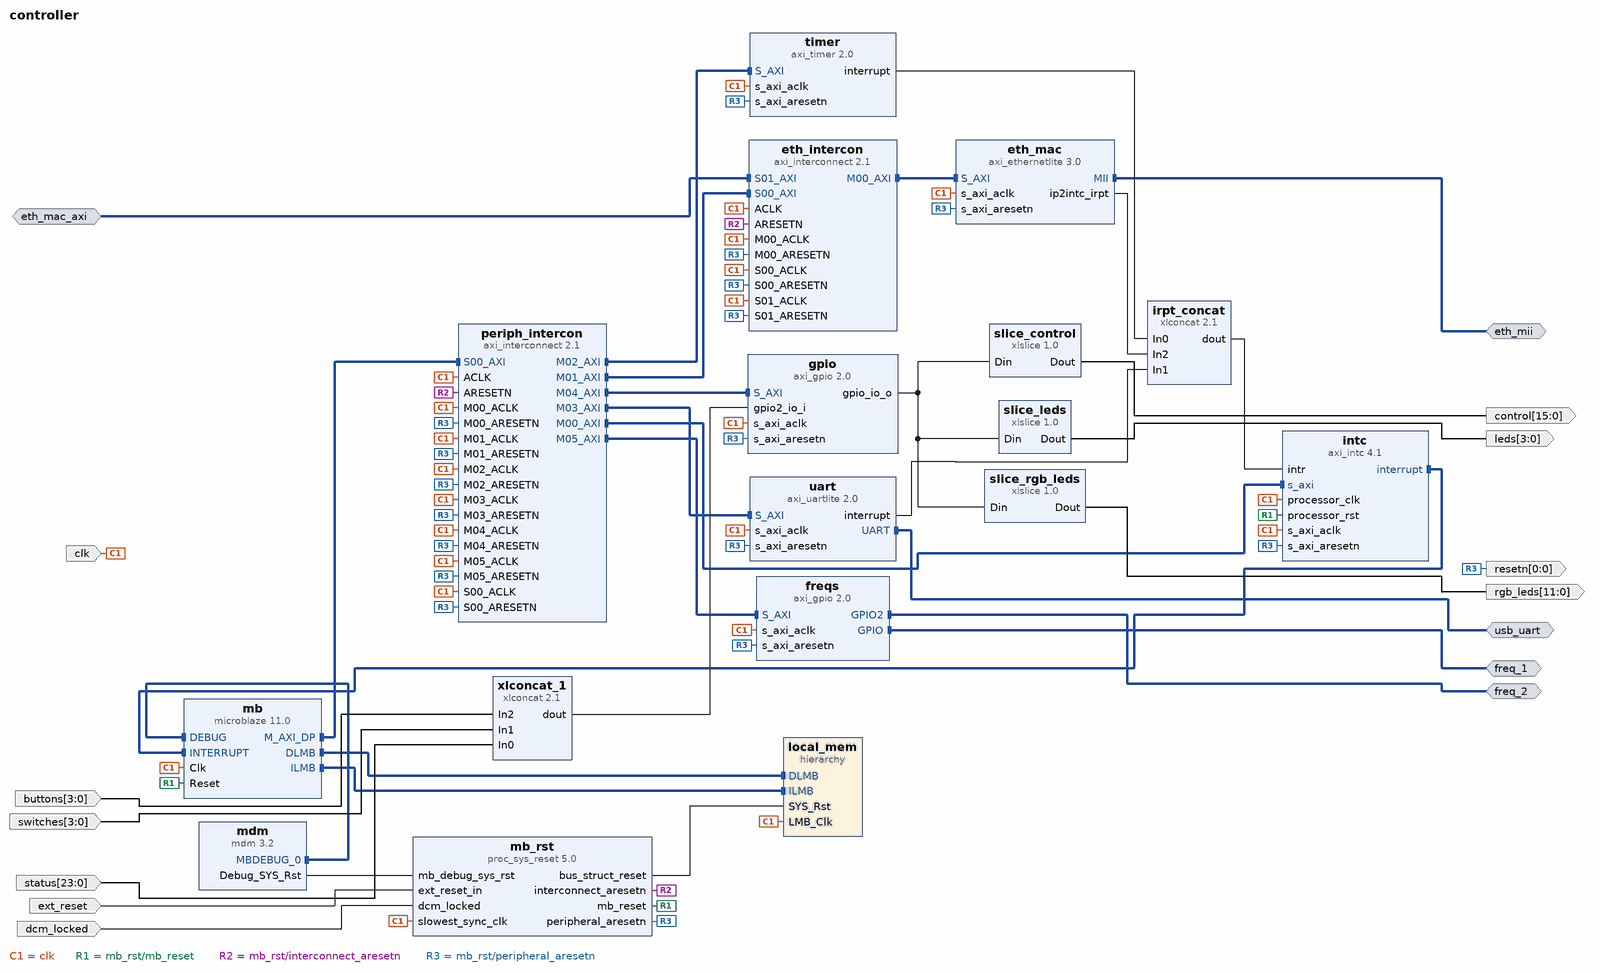
[diagram p0: block diagram of the top level]
# Vivado block design controller, xc7a35ticsg324-1L, Vivado 2019.1
create_bd_design controller

create_bd_intf_port -mode Master -vlnv xilinx.com:interface:mii_rtl:1.0 eth_mii
create_bd_intf_port -mode Slave -vlnv xilinx.com:interface:aximm_rtl:1.0 eth_mac_axi
set_property -dict [list \
  CONFIG.ADDR_WIDTH 32 \
  CONFIG.ARUSER_WIDTH 0 \
  CONFIG.AWUSER_WIDTH 0 \
  CONFIG.BUSER_WIDTH 0 \
  CONFIG.DATA_WIDTH 32 \
  CONFIG.HAS_BRESP 1 \
  CONFIG.HAS_BURST 1 \
  CONFIG.HAS_CACHE 1 \
  CONFIG.HAS_LOCK 1 \
  CONFIG.HAS_PROT 1 \
  CONFIG.HAS_QOS 1 \
  CONFIG.HAS_REGION 0 \
  CONFIG.HAS_RRESP 1 \
  CONFIG.HAS_WSTRB 1 \
  CONFIG.ID_WIDTH 0 \
  CONFIG.MAX_BURST_LENGTH 1 \
  CONFIG.NUM_READ_OUTSTANDING 2 \
  CONFIG.NUM_READ_THREADS 1 \
  CONFIG.NUM_WRITE_OUTSTANDING 2 \
  CONFIG.NUM_WRITE_THREADS 1 \
  CONFIG.PROTOCOL AXI4LITE \
  CONFIG.READ_WRITE_MODE READ_WRITE \
  CONFIG.RUSER_BITS_PER_BYTE 0 \
  CONFIG.RUSER_WIDTH 0 \
  CONFIG.SUPPORTS_NARROW_BURST 0 \
  CONFIG.WUSER_BITS_PER_BYTE 0 \
  CONFIG.WUSER_WIDTH 0 \
] [get_bd_intf_ports eth_mac_axi]
create_bd_intf_port -mode Master -vlnv xilinx.com:interface:uart_rtl:1.0 usb_uart
create_bd_intf_port -mode Master -vlnv xilinx.com:interface:gpio_rtl:1.0 freq_1
create_bd_intf_port -mode Master -vlnv xilinx.com:interface:gpio_rtl:1.0 freq_2
create_bd_port -dir I -type clk clk
set_property -dict {CONFIG.ASSOCIATED_RESET resetn CONFIG.FREQ_HZ 100000000} [get_bd_ports clk]
create_bd_port -dir O -from 0 -to 0 -type rst resetn
create_bd_port -dir I -type rst ext_reset
set_property -dict {CONFIG.POLARITY ACTIVE_LOW} [get_bd_ports ext_reset]
create_bd_port -dir I dcm_locked
create_bd_port -dir O -from 11 -to 0 rgb_leds
create_bd_port -dir O -from 15 -to 0 control
create_bd_port -dir O -from 3 -to 0 leds
create_bd_port -dir I -from 3 -to 0 buttons
create_bd_port -dir I -from 3 -to 0 switches
create_bd_port -dir I -from 23 -to 0 status

create_bd_cell -type hier local_mem
create_bd_cell -type ip -vlnv xilinx.com:ip:axi_intc:4.1 intc
set_property -dict {CONFIG.C_HAS_FAST 1} [get_bd_cells intc]
create_bd_cell -type ip -vlnv xilinx.com:ip:xlconcat:2.1 irpt_concat
set_property -dict {CONFIG.NUM_PORTS 3 CONFIG.dout_width 3} [get_bd_cells irpt_concat]
create_bd_cell -type ip -vlnv xilinx.com:ip:xlslice:1.0 slice_control
set_property -dict {CONFIG.DIN_FROM 15 CONFIG.DOUT_WIDTH 16} [get_bd_cells slice_control]
create_bd_cell -type ip -vlnv xilinx.com:ip:xlslice:1.0 slice_leds
set_property -dict {CONFIG.DIN_FROM 19 CONFIG.DIN_TO 16 CONFIG.DOUT_WIDTH 4} [get_bd_cells slice_leds]
create_bd_cell -type ip -vlnv xilinx.com:ip:xlslice:1.0 slice_rgb_leds
set_property -dict {CONFIG.DIN_FROM 31 CONFIG.DIN_TO 20 CONFIG.DIN_WIDTH 32 CONFIG.DOUT_WIDTH 12} [get_bd_cells slice_rgb_leds]
create_bd_cell -type ip -vlnv xilinx.com:ip:xlconcat:2.1 xlconcat_1
set_property -dict [list \
  CONFIG.IN0_WIDTH 24 \
  CONFIG.IN1_WIDTH 4 \
  CONFIG.IN2_WIDTH 4 \
  CONFIG.NUM_PORTS 3 \
  CONFIG.dout_width 32 \
] [get_bd_cells xlconcat_1]
create_bd_cell -type ip -vlnv xilinx.com:ip:axi_interconnect:2.1 eth_intercon
set_property -dict [list \
  CONFIG.ENABLE_ADVANCED_OPTIONS 1 \
  CONFIG.NUM_MI 1 \
  CONFIG.NUM_SI 2 \
  CONFIG.SYNCHRONIZATION_STAGES 2 \
] [get_bd_cells eth_intercon]
create_bd_cell -type ip -vlnv xilinx.com:ip:microblaze:11.0 mb
set_property -dict {CONFIG.C_DEBUG_ENABLED 1 CONFIG.C_D_AXI 1 CONFIG.C_D_LMB 1 CONFIG.C_I_LMB 1} [get_bd_cells mb]
create_bd_cell -type ip -vlnv xilinx.com:ip:mdm:3.2 mdm
create_bd_cell -type ip -vlnv xilinx.com:ip:axi_interconnect:2.1 periph_intercon
set_property -dict {CONFIG.NUM_MI 6 CONFIG.SYNCHRONIZATION_STAGES 2} [get_bd_cells periph_intercon]
create_bd_cell -type ip -vlnv xilinx.com:ip:axi_timer:2.0 timer
create_bd_cell -type ip -vlnv xilinx.com:ip:axi_ethernetlite:3.0 eth_mac
set_property -dict [list \
  CONFIG.C_INCLUDE_MDIO 0 \
  CONFIG.MDIO_BOARD_INTERFACE Custom \
  CONFIG.MII_BOARD_INTERFACE Custom \
  CONFIG.USE_BOARD_FLOW true \
] [get_bd_cells eth_mac]
create_bd_cell -type ip -vlnv xilinx.com:ip:axi_gpio:2.0 freqs
set_property -dict [list \
  CONFIG.C_ALL_OUTPUTS 1 \
  CONFIG.C_ALL_OUTPUTS_2 1 \
  CONFIG.C_DOUT_DEFAULT 0x00000EB8 \
  CONFIG.C_DOUT_DEFAULT_2 0x00001008 \
  CONFIG.C_IS_DUAL 1 \
] [get_bd_cells freqs]
create_bd_cell -type ip -vlnv xilinx.com:ip:axi_gpio:2.0 gpio
set_property -dict {CONFIG.C_ALL_INPUTS 0 CONFIG.C_ALL_INPUTS_2 1 CONFIG.C_ALL_OUTPUTS 1 CONFIG.C_IS_DUAL 1} [get_bd_cells gpio]
create_bd_cell -type ip -vlnv xilinx.com:ip:proc_sys_reset:5.0 mb_rst
set_property -dict {CONFIG.RESET_BOARD_INTERFACE Custom CONFIG.USE_BOARD_FLOW false} [get_bd_cells mb_rst]
create_bd_cell -type ip -vlnv xilinx.com:ip:axi_uartlite:2.0 uart
set_property -dict {CONFIG.UARTLITE_BOARD_INTERFACE Custom CONFIG.USE_BOARD_FLOW true} [get_bd_cells uart]

# ---- hierarchy /local_mem ----
current_bd_instance /local_mem
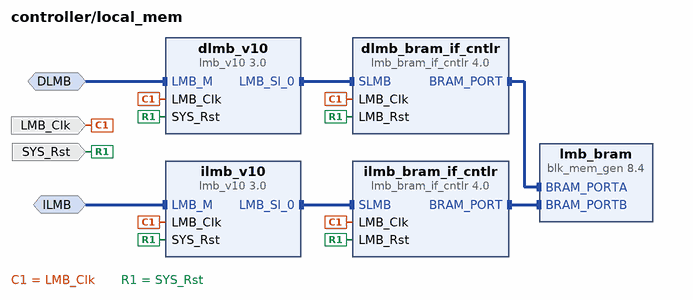
[diagram p1: block diagram inside /local_mem]
create_bd_intf_pin -mode MirroredMaster -vlnv xilinx.com:interface:lmb_rtl:1.0 DLMB
create_bd_intf_pin -mode MirroredMaster -vlnv xilinx.com:interface:lmb_rtl:1.0 ILMB
create_bd_pin -dir I -type clk LMB_Clk
create_bd_pin -dir I -type rst SYS_Rst

create_bd_cell -type ip -vlnv xilinx.com:ip:lmb_v10:3.0 dlmb_v10
create_bd_cell -type ip -vlnv xilinx.com:ip:lmb_v10:3.0 ilmb_v10
create_bd_cell -type ip -vlnv xilinx.com:ip:lmb_bram_if_cntlr:4.0 dlmb_bram_if_cntlr
set_property -dict {CONFIG.C_ECC 0} [get_bd_cells dlmb_bram_if_cntlr]
create_bd_cell -type ip -vlnv xilinx.com:ip:lmb_bram_if_cntlr:4.0 ilmb_bram_if_cntlr
set_property -dict {CONFIG.C_ECC 0} [get_bd_cells ilmb_bram_if_cntlr]
create_bd_cell -type ip -vlnv xilinx.com:ip:blk_mem_gen:8.4 lmb_bram
set_property -dict [list \
  CONFIG.EN_SAFETY_CKT false \
  CONFIG.Enable_B Use_ENB_Pin \
  CONFIG.Memory_Type True_Dual_Port_RAM \
  CONFIG.Port_B_Clock 100 \
  CONFIG.Port_B_Enable_Rate 100 \
  CONFIG.Port_B_Write_Rate 50 \
  CONFIG.Use_RSTB_Pin true \
  CONFIG.use_bram_block BRAM_Controller \
] [get_bd_cells lmb_bram]

# ---- connections ----

current_bd_instance /local_mem
connect_bd_intf_net -intf_net microblaze_0_dlmb [get_bd_intf_pins DLMB] [get_bd_intf_pins dlmb_v10/LMB_M]
connect_bd_intf_net -intf_net microblaze_0_dlmb_bus [get_bd_intf_pins dlmb_v10/LMB_Sl_0] [get_bd_intf_pins dlmb_bram_if_cntlr/SLMB]
connect_bd_intf_net -intf_net microblaze_0_ilmb_cntlr [get_bd_intf_pins ilmb_bram_if_cntlr/BRAM_PORT] [get_bd_intf_pins lmb_bram/BRAM_PORTB]
connect_bd_intf_net -intf_net microblaze_0_ilmb [get_bd_intf_pins ILMB] [get_bd_intf_pins ilmb_v10/LMB_M]
connect_bd_intf_net -intf_net microblaze_0_dlmb_cntlr [get_bd_intf_pins dlmb_bram_if_cntlr/BRAM_PORT] [get_bd_intf_pins lmb_bram/BRAM_PORTA]
connect_bd_intf_net -intf_net microblaze_0_ilmb_bus [get_bd_intf_pins ilmb_v10/LMB_Sl_0] [get_bd_intf_pins ilmb_bram_if_cntlr/SLMB]
connect_bd_net -net microblaze_0_Clk [get_bd_pins LMB_Clk] \
  [get_bd_pins dlmb_v10/LMB_Clk] [get_bd_pins ilmb_v10/LMB_Clk] [get_bd_pins dlmb_bram_if_cntlr/LMB_Clk] \
  [get_bd_pins ilmb_bram_if_cntlr/LMB_Clk]
connect_bd_net [get_bd_pins SYS_Rst] \
  [get_bd_pins dlmb_v10/SYS_Rst] [get_bd_pins ilmb_v10/SYS_Rst] [get_bd_pins dlmb_bram_if_cntlr/LMB_Rst] \
  [get_bd_pins ilmb_bram_if_cntlr/LMB_Rst]
set_property HDL_ATTRIBUTE.BMM_INFO_ADDRESS_SPACE {byte  0x00000000 32 > controller local_mem/lmb_bram} [get_bd_cells dlmb_bram_if_cntlr]
set_property HDL_ATTRIBUTE.KEEP_HIERARCHY yes [get_bd_cells dlmb_bram_if_cntlr]

current_bd_instance /
connect_bd_intf_net [get_bd_intf_ports eth_mac_axi] [get_bd_intf_pins eth_intercon/S01_AXI]
connect_bd_intf_net -intf_net axi_uartlite_0_UART [get_bd_intf_ports usb_uart] [get_bd_intf_pins uart/UART]
connect_bd_intf_net -intf_net microblaze_0_dlmb_1 [get_bd_intf_pins mb/DLMB] [get_bd_intf_pins local_mem/DLMB]
connect_bd_intf_net [get_bd_intf_pins periph_intercon/M04_AXI] [get_bd_intf_pins gpio/S_AXI]
connect_bd_intf_net -intf_net microblaze_0_axi_dp [get_bd_intf_pins periph_intercon/S00_AXI] [get_bd_intf_pins mb/M_AXI_DP]
connect_bd_intf_net [get_bd_intf_ports freq_2] [get_bd_intf_pins freqs/GPIO2]
connect_bd_intf_net [get_bd_intf_pins periph_intercon/M05_AXI] [get_bd_intf_pins freqs/S_AXI]
connect_bd_intf_net -intf_net axi_interconnect_0_M00_AXI [get_bd_intf_pins eth_intercon/M00_AXI] [get_bd_intf_pins eth_mac/S_AXI]
connect_bd_intf_net -intf_net peripheral_interconnect_M03_AXI [get_bd_intf_pins periph_intercon/M03_AXI] [get_bd_intf_pins uart/S_AXI]
connect_bd_intf_net -intf_net microblaze_0_interrupt [get_bd_intf_pins intc/interrupt] [get_bd_intf_pins mb/INTERRUPT]
connect_bd_intf_net -intf_net peripheral_interconnect_M02_AXI [get_bd_intf_pins periph_intercon/M02_AXI] [get_bd_intf_pins timer/S_AXI]
connect_bd_intf_net [get_bd_intf_pins periph_intercon/M01_AXI] [get_bd_intf_pins eth_intercon/S00_AXI]
connect_bd_intf_net -intf_net axi_ethernetlite_0_MII [get_bd_intf_ports eth_mii] [get_bd_intf_pins eth_mac/MII]
connect_bd_intf_net -intf_net microblaze_0_debug [get_bd_intf_pins mdm/MBDEBUG_0] [get_bd_intf_pins mb/DEBUG]
connect_bd_intf_net -intf_net microblaze_0_ilmb_1 [get_bd_intf_pins mb/ILMB] [get_bd_intf_pins local_mem/ILMB]
connect_bd_intf_net [get_bd_intf_ports freq_1] [get_bd_intf_pins freqs/GPIO]
connect_bd_intf_net -intf_net microblaze_0_intc_axi [get_bd_intf_pins periph_intercon/M00_AXI] [get_bd_intf_pins intc/s_axi]
connect_bd_net -net microblaze_0_intr [get_bd_pins irpt_concat/dout] [get_bd_pins intc/intr]
connect_bd_net -net microblaze_0_Clk [get_bd_ports clk] \
  [get_bd_pins intc/s_axi_aclk] [get_bd_pins intc/processor_clk] [get_bd_pins mb/Clk] [get_bd_pins timer/s_axi_aclk] \
  [get_bd_pins local_mem/LMB_Clk] [get_bd_pins eth_intercon/ACLK] [get_bd_pins eth_intercon/S00_ACLK] \
  [get_bd_pins eth_intercon/S01_ACLK] [get_bd_pins eth_intercon/M00_ACLK] [get_bd_pins periph_intercon/ACLK] \
  [get_bd_pins periph_intercon/S00_ACLK] [get_bd_pins periph_intercon/M00_ACLK] [get_bd_pins periph_intercon/M01_ACLK] \
  [get_bd_pins periph_intercon/M02_ACLK] [get_bd_pins periph_intercon/M03_ACLK] [get_bd_pins periph_intercon/M04_ACLK] \
  [get_bd_pins periph_intercon/M05_ACLK] [get_bd_pins eth_mac/s_axi_aclk] [get_bd_pins freqs/s_axi_aclk] \
  [get_bd_pins gpio/s_axi_aclk] [get_bd_pins mb_rst/slowest_sync_clk] [get_bd_pins uart/s_axi_aclk]
connect_bd_net -net rst_Clk_100M_mb_reset [get_bd_pins mb_rst/mb_reset] [get_bd_pins intc/processor_rst] [get_bd_pins mb/Reset]
connect_bd_net -net rst_Clk_100M_bus_struct_reset [get_bd_pins mb_rst/bus_struct_reset] [get_bd_pins local_mem/SYS_Rst]
connect_bd_net -net rst_Clk_100M_interconnect_aresetn [get_bd_pins mb_rst/interconnect_aresetn] \
  [get_bd_pins eth_intercon/ARESETN] [get_bd_pins periph_intercon/ARESETN]
connect_bd_net -net rst_Clk_100M_peripheral_aresetn [get_bd_pins mb_rst/peripheral_aresetn] \
  [get_bd_ports resetn] [get_bd_pins intc/s_axi_aresetn] [get_bd_pins timer/s_axi_aresetn] \
  [get_bd_pins eth_intercon/S00_ARESETN] [get_bd_pins eth_intercon/S01_ARESETN] [get_bd_pins eth_intercon/M00_ARESETN] \
  [get_bd_pins periph_intercon/S00_ARESETN] [get_bd_pins periph_intercon/M00_ARESETN] \
  [get_bd_pins periph_intercon/M01_ARESETN] [get_bd_pins periph_intercon/M02_ARESETN] \
  [get_bd_pins periph_intercon/M03_ARESETN] [get_bd_pins periph_intercon/M04_ARESETN] \
  [get_bd_pins periph_intercon/M05_ARESETN] [get_bd_pins eth_mac/s_axi_aresetn] [get_bd_pins freqs/s_axi_aresetn] \
  [get_bd_pins gpio/s_axi_aresetn] [get_bd_pins uart/s_axi_aresetn]
connect_bd_net -net mdm_1_debug_sys_rst [get_bd_pins mdm/Debug_SYS_Rst] [get_bd_pins mb_rst/mb_debug_sys_rst]
connect_bd_net -net reset_1 [get_bd_ports ext_reset] [get_bd_pins mb_rst/ext_reset_in]
connect_bd_net [get_bd_ports dcm_locked] [get_bd_pins mb_rst/dcm_locked]
connect_bd_net -net axi_timer_0_interrupt [get_bd_pins timer/interrupt] [get_bd_pins irpt_concat/In0]
connect_bd_net -net axi_uartlite_0_interrupt [get_bd_pins uart/interrupt] [get_bd_pins irpt_concat/In1]
connect_bd_net -net ethernet_mac_ip2intc_irpt [get_bd_pins eth_mac/ip2intc_irpt] [get_bd_pins irpt_concat/In2]
connect_bd_net [get_bd_pins gpio/gpio_io_o] [get_bd_pins slice_control/Din] [get_bd_pins slice_leds/Din] [get_bd_pins slice_rgb_leds/Din]
connect_bd_net [get_bd_pins slice_rgb_leds/Dout] [get_bd_ports rgb_leds]
connect_bd_net [get_bd_pins slice_control/Dout] [get_bd_ports control]
connect_bd_net [get_bd_pins slice_leds/Dout] [get_bd_ports leds]
connect_bd_net [get_bd_pins xlconcat_1/dout] [get_bd_pins gpio/gpio2_io_i]
connect_bd_net [get_bd_ports buttons] [get_bd_pins xlconcat_1/In2]
connect_bd_net [get_bd_ports switches] [get_bd_pins xlconcat_1/In1]
connect_bd_net [get_bd_ports status] [get_bd_pins xlconcat_1/In0]
set_property HDL_ATTRIBUTE.BMM_INFO_PROCESSOR {microblaze-le > controller local_mem/dlmb_bram_if_cntlr} [get_bd_cells mb]
set_property HDL_ATTRIBUTE.KEEP_HIERARCHY yes [get_bd_cells mb]

# ---- address map ----
assign_bd_address -offset 0x40E00000 -range 64K -target_address_space [get_bd_addr_spaces eth_mac_axi] [get_bd_addr_segs eth_mac/S_AXI/Reg]
assign_bd_address -offset 0x00000000 -range 32K -target_address_space [get_bd_addr_spaces mb/Data] [get_bd_addr_segs local_mem/dlmb_bram_if_cntlr/SLMB/Mem]
assign_bd_address -offset 0x40000000 -range 64K -target_address_space [get_bd_addr_spaces mb/Data] [get_bd_addr_segs gpio/S_AXI/Reg]
assign_bd_address -offset 0x40010000 -range 64K -target_address_space [get_bd_addr_spaces mb/Data] [get_bd_addr_segs freqs/S_AXI/Reg]
assign_bd_address -offset 0x40600000 -range 64K -target_address_space [get_bd_addr_spaces mb/Data] [get_bd_addr_segs uart/S_AXI/Reg]
assign_bd_address -offset 0x40E00000 -range 64K -target_address_space [get_bd_addr_spaces mb/Data] [get_bd_addr_segs eth_mac/S_AXI/Reg]
assign_bd_address -offset 0x41200000 -range 64K -target_address_space [get_bd_addr_spaces mb/Data] [get_bd_addr_segs intc/S_AXI/Reg]
assign_bd_address -offset 0x41C00000 -range 64K -target_address_space [get_bd_addr_spaces mb/Data] [get_bd_addr_segs timer/S_AXI/Reg]
assign_bd_address -offset 0x00000000 -range 32K -target_address_space [get_bd_addr_spaces mb/Instruction] [get_bd_addr_segs local_mem/ilmb_bram_if_cntlr/SLMB/Mem]

validate_bd_design
save_bd_design
